# EAGLE design Pi3_Power_hat_Rev1 (EAGLE 7.6.0)

## Sheet 1 of 4
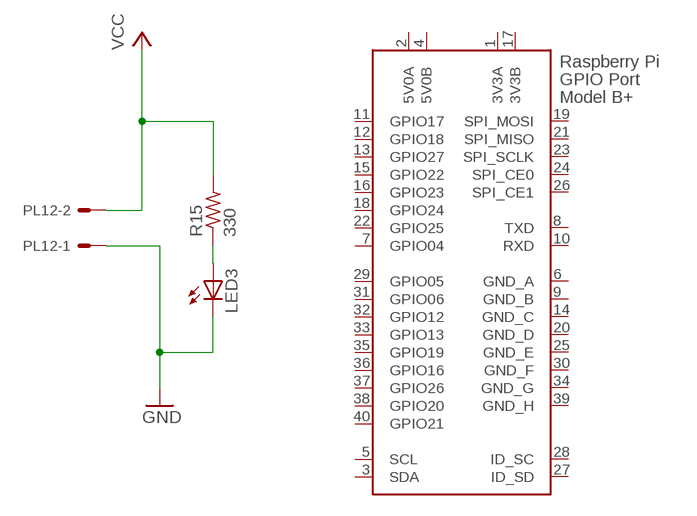
[diagram p0: schematic, sheet 1]

### Parts
LED3  LEDCHIP-LED0603  [CHIP-LED0603]
PL12  555X-2H  [5569-2]
R15  330  R-US_R0402  [R0402]
X1  RASPI_BOARD_B+#_E4P  [RASPI_BOARD_B+_EDGES_4DRILL_PAD]

### Nets
GND: LED3.C PL12.1 ; also sheet 2,3,4
N$24: LED3.A R15.1
VCC: PL12.2 R15.2 ; also sheet 2,3,4
Unconnected: X1.3(SDA) X1.5(SCL) X1.7(GPIO04) X1.8(TXD) X1.10(RXD) X1.11(GPIO17) X1.12(GPIO18) X1.13(GPIO27) X1.15(GPIO22) X1.16(GPIO23) X1.18(GPIO24) X1.19(SPI_MOSI) X1.21(SPI_MISO) X1.22(GPIO25) X1.23(SPI_SCLK) X1.24(SPI_CE0) X1.26(SPI_CE1) X1.27(ID_SD) X1.28(ID_SC) X1.29(GPIO05) X1.31(GPIO06) X1.32(GPIO12) X1.33(GPIO13) X1.35(GPIO19) X1.36(GPIO16) X1.37(GPIO26) X1.38(GPIO20) X1.40(GPIO21)

## Sheet 2 of 4
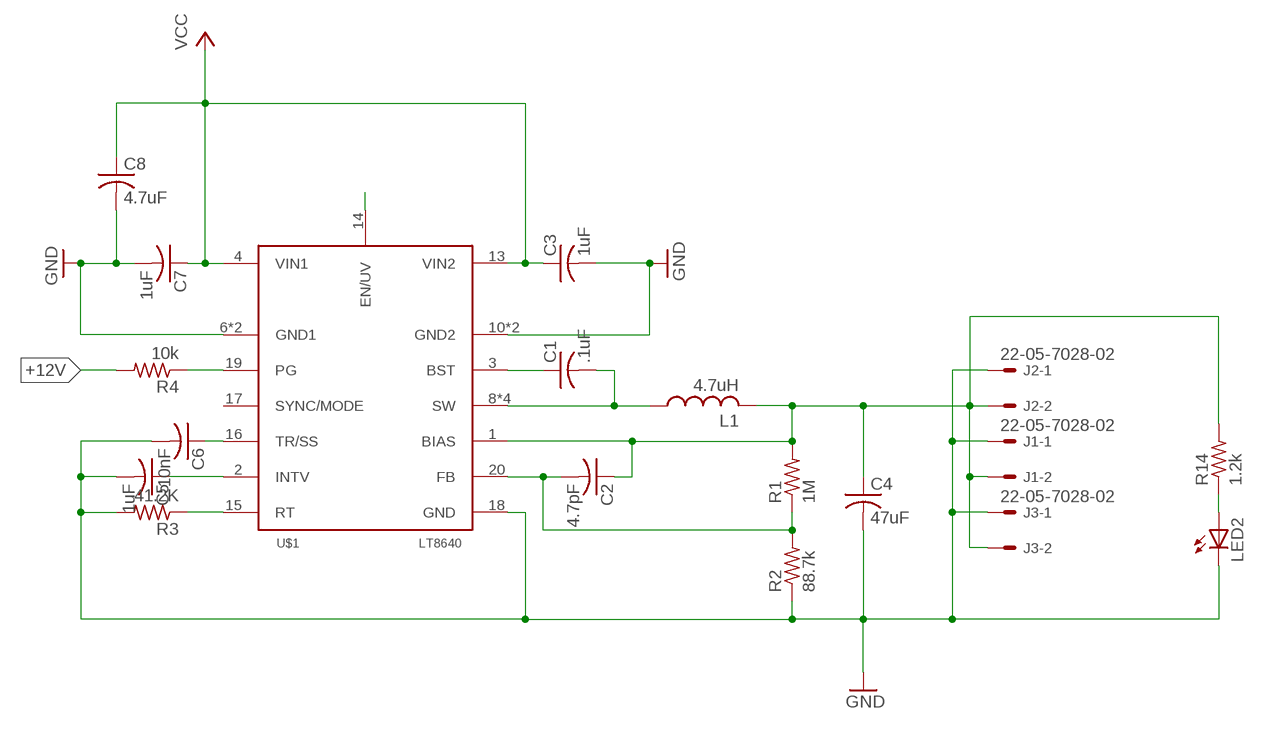
[diagram p1: schematic, sheet 2]

### Parts
C1  .1uF  C-USC0402  [C0402]
C2  4.7pF  C-USC0402  [C0402]
C3  1uF  C-USC0402  [C0402]
C4  47uF  C-USC1210  [C1210]
C5  1uF  C-USC0402  [C0402]
C6  10nF  C-USC0402  [C0402]
C7  1uF  C-USC0402  [C0402]
C8  4.7uF  C-USC0603  [C0603]
J1  22-05-7028-02  [7395-02]
J2  22-05-7028-02  [7395-02]
J3  22-05-7028-02  [7395-02]
L1  4.7uH  L-USIHLP2525EZER4R7M01  [IHLP2525EZER4R7M01-FOOT]
LED2  LEDCHIP-LED0603  [CHIP-LED0603]
R1  1M  R-US_R0402  [R0402]
R2  88.7k  R-US_R0402  [R0402]
R3  41.2K  R-US_R0402  [R0402]
R4  10k  R-US_R0402  [R0402]
R14  1.2k  R-US_R0402  [R0402]
U$1  LT8640  [LT8640_FOOT]

### Nets
+12V: C2.1 C4.1 J1.2 J2.2 J3.2 L1.2 R1.2 R4.2 R14.2 U$1.1(BIAS)
GND: C3.2 C4.2 C5.2 C6.2 C7.2 C8.2 J1.1 J2.1 J3.1 LED2.C R2.1 R3.2 U$1.6(GND1) U$1.7(GND1) U$1.10(GND2) U$1.11(GND2) U$1.18(GND) ; also sheet 1,3,4
N$1: C1.1 U$1.3(BST)
N$2: C1.2 L1.1 U$1.8(SW) U$1.9(SW) U$1.21(SW) U$1.22(SW)
N$3: R4.1 U$1.19(PG)
N$5: C2.2 R1.1 R2.2 U$1.20(FB)
N$10: C6.1 U$1.16(TR/SS)
N$11: C5.1 U$1.2(INTV)
N$12: R3.1 U$1.15(RT)
N$23: LED2.A R14.1
N$26: U$1.14(EN/UV)
VCC: C3.1 C7.1 C8.1 U$1.4(VIN1) U$1.13(VIN2) ; also sheet 1,3,4
Unconnected: U$1.17(SYNC/MODE)

## Sheet 3 of 4
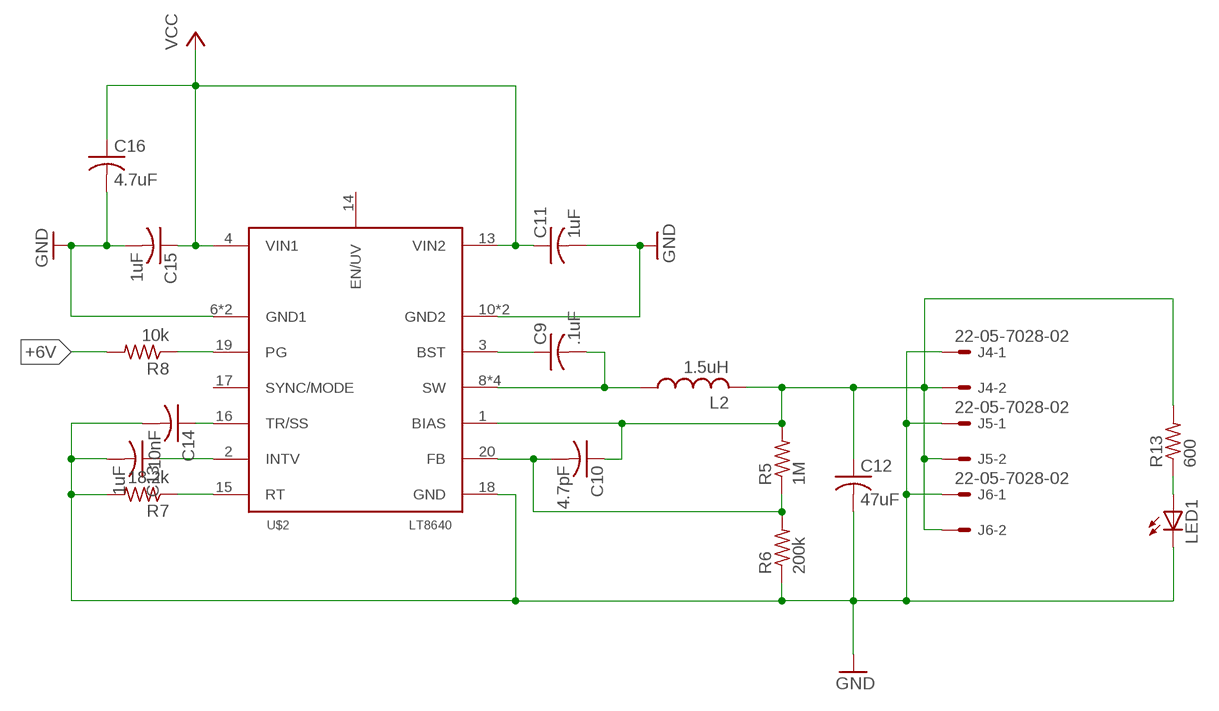
[diagram p2: schematic, sheet 3]

### Parts
C9  .1uF  C-USC0402  [C0402]
C10  4.7pF  C-USC0402  [C0402]
C11  1uF  C-USC0402  [C0402]
C12  47uF  C-USC1210  [C1210]
C13  1uF  C-USC0402  [C0402]
C14  10nF  C-USC0402  [C0402]
C15  1uF  C-USC0402  [C0402]
C16  4.7uF  C-USC0603  [C0603]
J4  22-05-7028-02  [7395-02]
J5  22-05-7028-02  [7395-02]
J6  22-05-7028-02  [7395-02]
L2  1.5uH  L-USIHLP2525EZER4R7M01  [IHLP2525EZER4R7M01-FOOT]
LED1  LEDCHIP-LED0603  [CHIP-LED0603]
R5  1M  R-US_R0402  [R0402]
R6  200k  R-US_R0402  [R0402]
R7  18.2k  R-US_R0402  [R0402]
R8  10k  R-US_R0402  [R0402]
R13  600  R-US_R0402  [R0402]
U$2  LT8640  [LT8640_FOOT]

### Nets
+6V: C10.1 C12.1 J4.2 J5.2 J6.2 L2.2 R5.2 R8.2 R13.2 U$2.1(BIAS)
GND: C11.2 C12.2 C13.2 C14.2 C15.2 C16.2 J4.1 J5.1 J6.1 LED1.C R6.1 R7.2 U$2.6(GND1) U$2.7(GND1) U$2.10(GND2) U$2.11(GND2) U$2.18(GND) ; also sheet 1,2,4
N$4: C9.1 U$2.3(BST)
N$6: C9.2 L2.1 U$2.8(SW) U$2.9(SW) U$2.21(SW) U$2.22(SW)
N$7: C10.2 R5.1 R6.2 U$2.20(FB)
N$8: C14.1 U$2.16(TR/SS)
N$9: C13.1 U$2.2(INTV)
N$13: R7.1 U$2.15(RT)
N$14: R8.1 U$2.19(PG)
N$25: LED1.A R13.1
VCC: C11.1 C15.1 C16.1 U$2.4(VIN1) U$2.13(VIN2) ; also sheet 1,2,4
Unconnected: U$2.14(EN/UV) U$2.17(SYNC/MODE)

## Sheet 4 of 4
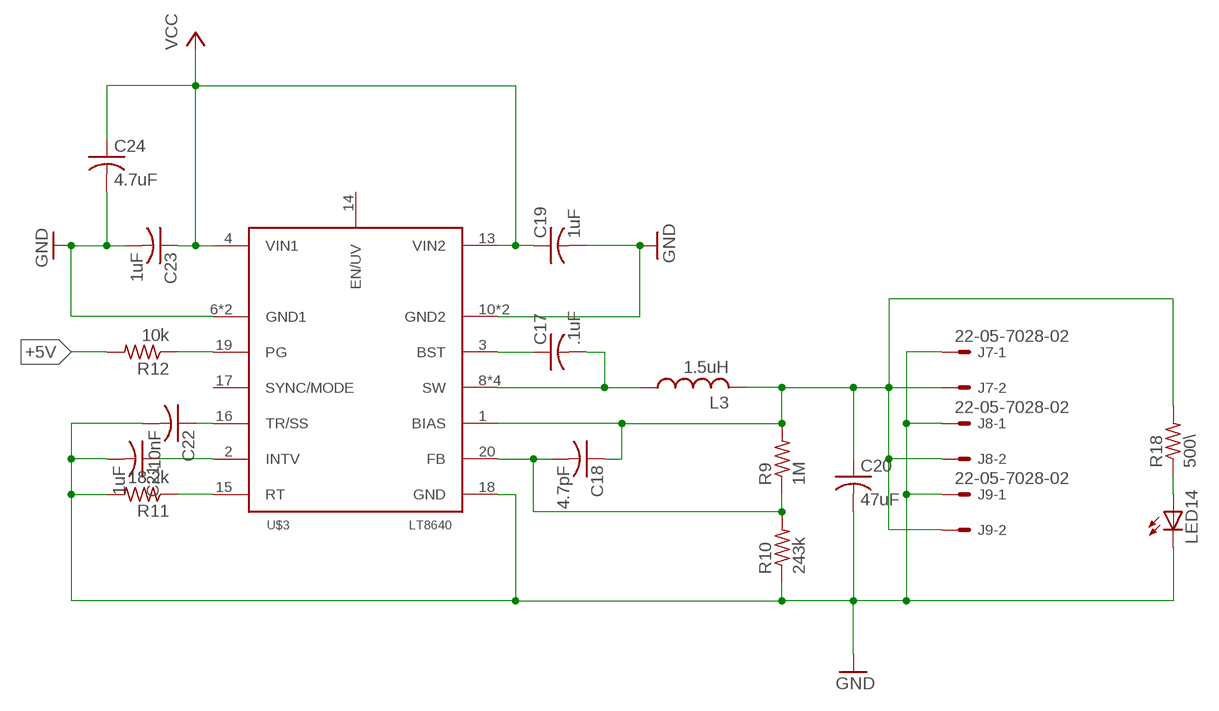
[diagram p3: schematic, sheet 4]

### Parts
C17  .1uF  C-USC0402  [C0402]
C18  4.7pF  C-USC0402  [C0402]
C19  1uF  C-USC0402  [C0402]
C20  47uF  C-USC1210  [C1210]
C21  1uF  C-USC0402  [C0402]
C22  10nF  C-USC0402  [C0402]
C23  1uF  C-USC0402  [C0402]
C24  4.7uF  C-USC0603  [C0603]
J7  22-05-7028-02  [7395-02]
J8  22-05-7028-02  [7395-02]
J9  22-05-7028-02  [7395-02]
L3  1.5uH  L-USIHLP2525EZER4R7M01  [IHLP2525EZER4R7M01-FOOT]
LED14  LEDCHIP-LED0603  [CHIP-LED0603]
R9  1M  R-US_R0402  [R0402]
R10  243k  R-US_R0402  [R0402]
R11  18.2k  R-US_R0402  [R0402]
R12  10k  R-US_R0402  [R0402]
R18  500\  R-US_R0402  [R0402]
U$3  LT8640  [LT8640_FOOT]

### Nets
+5V: C18.1 C20.1 J7.2 J8.2 J9.2 L3.2 R9.2 R12.2 R18.2 U$3.1(BIAS)
GND: C19.2 C20.2 C21.2 C22.2 C23.2 C24.2 J7.1 J8.1 J9.1 LED14.C R10.1 R11.2 U$3.6(GND1) U$3.7(GND1) U$3.10(GND2) U$3.11(GND2) U$3.18(GND) ; also sheet 1,2,3
N$15: C17.1 U$3.3(BST)
N$16: C17.2 L3.1 U$3.8(SW) U$3.9(SW) U$3.21(SW) U$3.22(SW)
N$17: C18.2 R9.1 R10.2 U$3.20(FB)
N$18: C22.1 U$3.16(TR/SS)
N$19: C21.1 U$3.2(INTV)
N$20: R11.1 U$3.15(RT)
N$21: R12.1 U$3.19(PG)
N$22: LED14.A R18.1
VCC: C19.1 C23.1 C24.1 U$3.4(VIN1) U$3.13(VIN2) ; also sheet 1,2,3
Unconnected: U$3.14(EN/UV) U$3.17(SYNC/MODE)

## Power pins joined to a net without a drawn wire
3V3A: X1.1(3V3A)
3V3B: X1.17(3V3B)
5V0A: X1.2(5V0A)
5V0B: X1.4(5V0B)
GND_A: X1.6(GND_A)
GND_B: X1.9(GND_B)
GND_C: X1.14(GND_C)
GND_D: X1.20(GND_D)
GND_E: X1.25(GND_E)
GND_F: X1.30(GND_F)
GND_G: X1.34(GND_G)
GND_H: X1.39(GND_H)

## Library data of the parts
C1-C24 = rcl:C-US: CAPACITOR, American symbol
J1-J9 = con-molex:22-?-02: CONNECTOR wire to board 2.54 mm (.1 inch) pitch header; OC_FARNELL: 9731601; OC_NEWARK: unknown
L1-L3 = Pi3_motor_hat_rev1:L-US: INDUCTOR, American symbol
LED1-LED3 LED14 = led:LED: LED OSRAM: - CHIPLED LG R971, LG N971, LY N971, LG Q971, LY Q971, LO R971, LY R971 LH N974, LH R974 LS Q976, LO Q976, LY Q976 LO Q996 - Hyper CHIPLED LW Q18S LB Q993, LB Q99A, LB R99A - SideLED LS A670, LO A670, LY A670, LG A670, LP A670 LB A673, LV A673, LT A673, LW A673 LH A674 LY A675 LS A676, LA A676, LO A676, LY A676, LW A676 LS A679, LY A679, LG A679 - Hyper Micro SIDELED® LS Y876, LA Y876, LO Y876, LY Y876 LT Y87S - SmartLED LW L88C, LW L88S LB L89C, LB L89S, LG L890 LS L89K, LO L89K, LY L89K LS L896, LA L896, LO L896, LY L896 - TOPLED LS T670, LO T670, LY T670, LG T670, LP T670 LSG T670, LSP T670, LSY T670, LOP T670, LYG T670 LG T671, LOG T671, LSG T671 LB T673, LV T673, LT T673, LW T673 LH T674 LS T676, LA T676, LO T676, LY T676, LB T676, LH T676, LSB T676, LW T676 LB T67C, LV T67C, LT T67C, LS T67K, LO T67K, LY T67K, LW E67C LS E67B, LA E67B, LO E67B, LY E67B, LB E67C, LV E67C, LT E67C LW T67C LS T679, LY T679, LG T679 LS T770, LO T770, LY T770, LG T770, LP T770 LB T773, LV T773, LT T773, LW T773 LH T774 LS E675, LA E675, LY E675, LS T675 LS T776, LA T776, LO T776, LY T776, LB T776 LHGB T686 LT T68C, LB T68C - Hyper Mini TOPLED® LB M676 - Mini TOPLED Santana® LG M470 LS M47K, LO M47K, LY M47K Source: http://www.osram.convergy.de LUXEON: - LUMILED® LXK2-PW12-R00, LXK2-PW12-S00, LXK2-PW14-U00, LXK2-PW14-V00 LXK2-PM12-R00, LXK2-PM12-S00, LXK2-PM14-U00 LXK2-PE12-Q00, LXK2-PE12-R00, LXK2-PE12-S00, LXK2-PE14-T00, LXK2-PE14-U00 LXK2-PB12-K00, LXK2-PB12-L00, LXK2-PB12-M00, LXK2-PB14-N00, LXK2-PB14-P00, LXK2-PB14-Q00 LXK2-PR12-L00, LXK2-PR12-M00, LXK2-PR14-Q00, LXK2-PR14-R00 LXK2-PD12-Q00, LXK2-PD12-R00, LXK2-PD12-S00 LXK2-PH12-R00, LXK2-PH12-S00 LXK2-PL12-P00, LXK2-PL12-Q00, LXK2-PL12-R00 Source: www.luxeon.com KINGBRIGHT: KA-3528ASYC Source: www.kingbright.com
PL12 = con-molex-2:555X-2: Mini FIT connector 2 way
R1-R15 R18 = rcl:R-US_: RESISTOR, American symbol
U$1-U$3 = Pi3_motor_hat_rev1:LT8640
X1 = Pi3_Power_hat_Rev1:RASPI_BOARD_B+#: Raspberry Pi GPIO connector with markings for the outer dimensions of the Raspberry Pi board model B+ with different sets of drill holes or mounting pads All pins connected

## Net classes
0 default: width 0.203 mm, drill 0.33 mm, clearance 0.254 mm

## Board
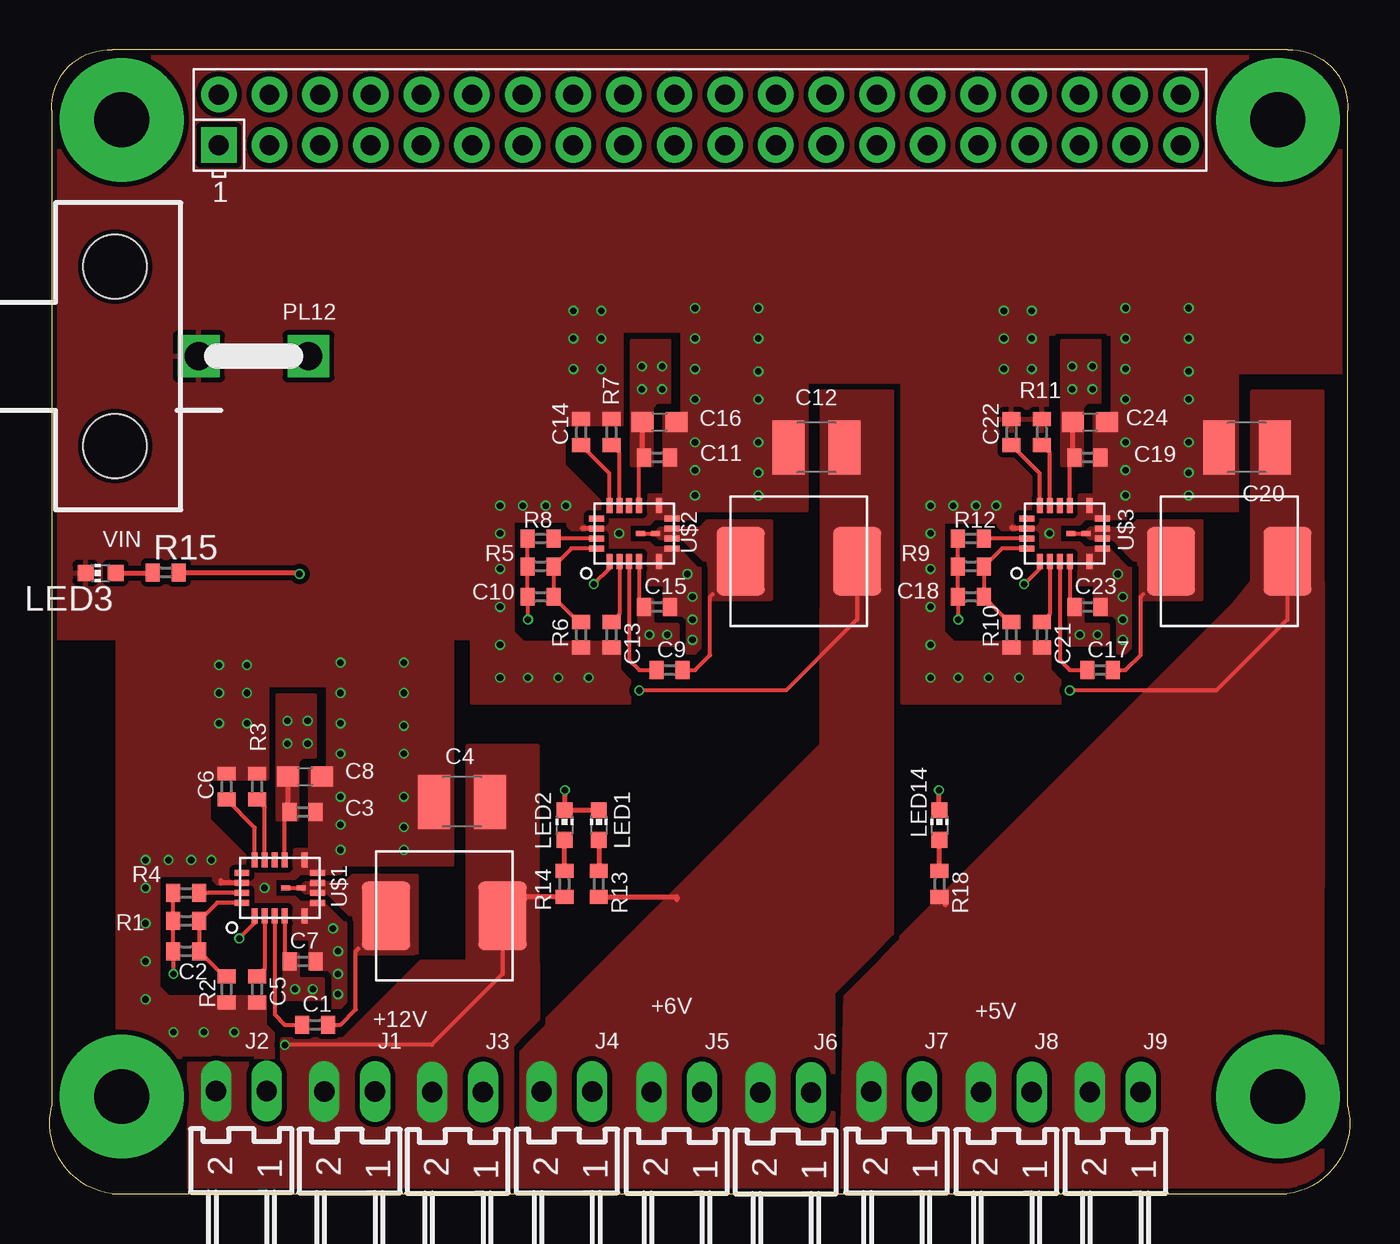
[diagram p4: board, top side]
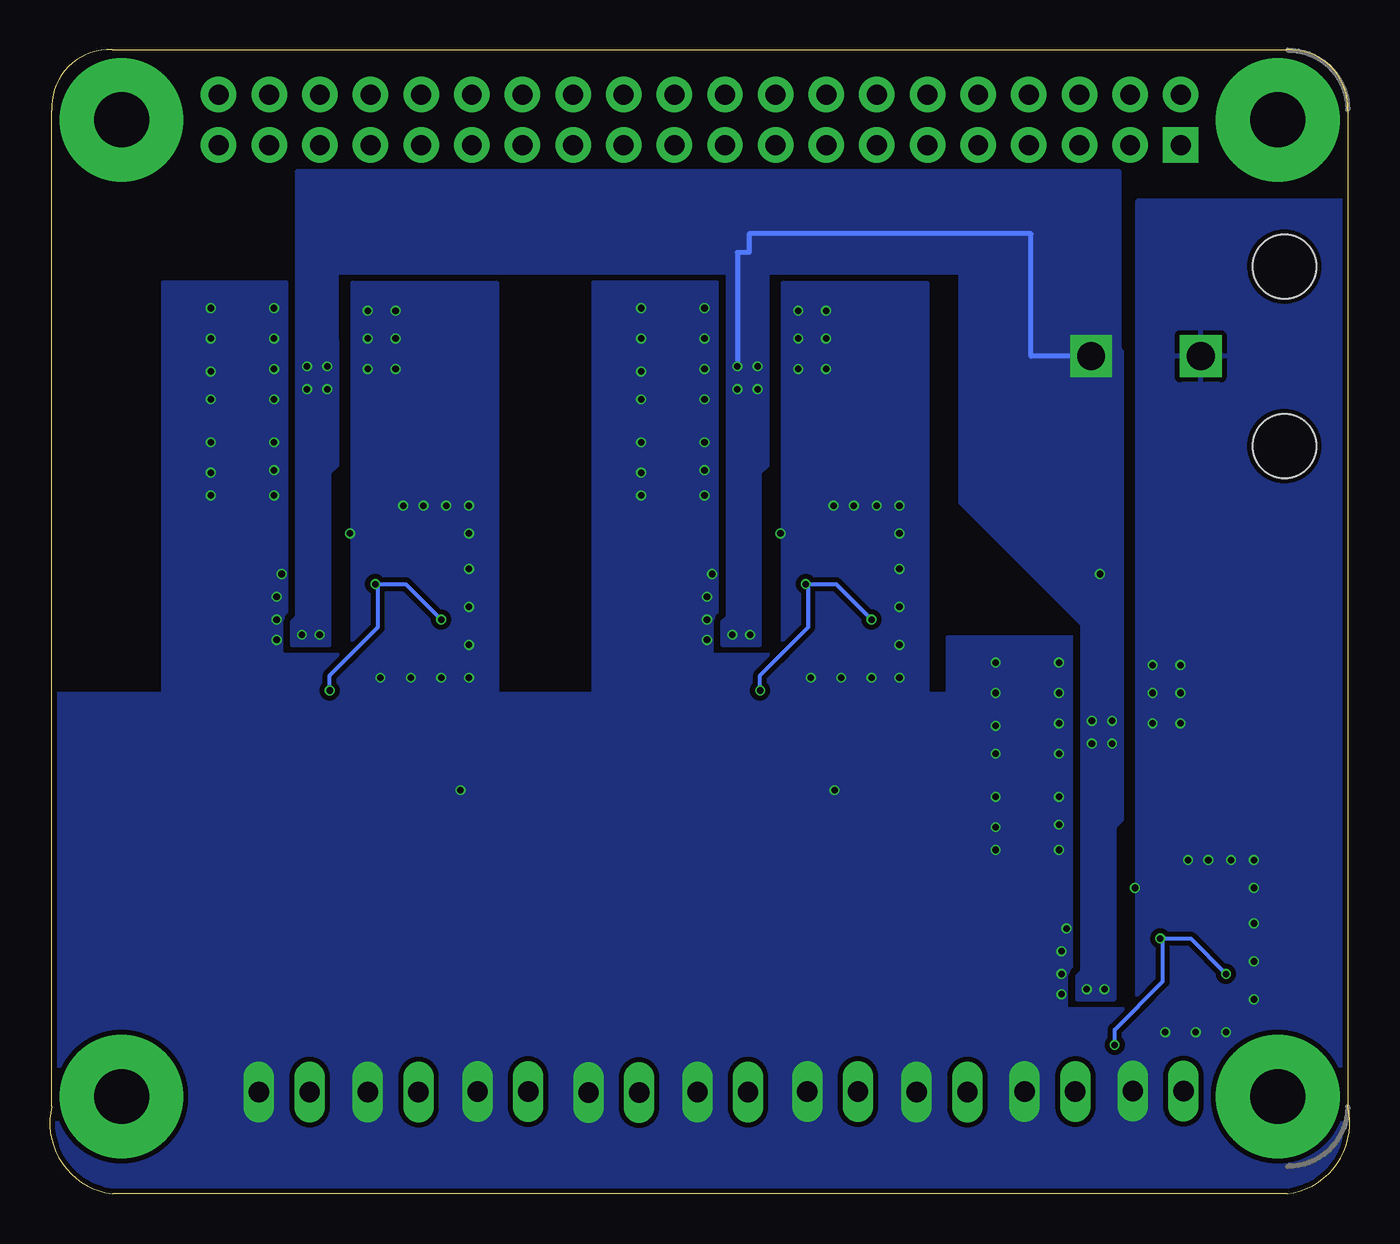
[diagram p5: board, bottom side, seen from below]

Size 65.2 x 57.38 mm. Coordinates in mm from the lower left corner, seen from the top.
Outline: 0.11,54.36 0.11,4.42 arc97 3.13,0 62.06,0 arc97 65.1,4.39 65.1,54.33 arc97 62.08,57.38 3.15,57.38 arc97 0.11,54.36
Copper layers (1*16): Top 0.035mm / dielectric 1.5mm / Bottom 0.035mm
Design rules "EagleRules-2-Layer-Shep": minimum track width 6mil, minimum drill 12mil, track to track 6mil, track to pad 6mil, pad to pad 6mil, via to via 6mil, smd to smd 0mil, copper to edge 10mil, drill to drill 10mil, minimum pad ring 2mil, minimum via ring 2mil, stop-mask expansion 2mil, vias tented up to drill 100mil, thermal gap 10mil

### Footprints (pad centres in the part's own frame; a part is rotated, then mirrored left to right if it is on the bottom)
C0402 = smd 0.7 x 0.9: 1 -0.65,0; 2 0.65,0
C1210 = smd 1.6 x 2.7: 1 -1.4,0; 2 1.4,0
C0603 = smd 1.1 x 1: 1 -0.85,0; 2 0.85,0
7395-02 = drill 1.016 long: 1 1.27,0; 2 -1.27,0
IHLP2525EZER4R7M01-FOOT = smd 2.413 x 3.429: 1 -2.921,0; 2 2.921,0
CHIP-LED0603 = smd 0.8 x 0.8: A 0,-0.75; C 0,0.75
5569-2 = drill 1.4 square: 1 0,0; 2 0,5.5 | hole 3.2: 4.5,-4.2; -4.5,-4.2
R0402 = smd 0.7 x 0.9: 1 -0.65,0; 2 0.65,0
LT8640_FOOT = smd 0.3 x 0.75: 1 1.25,1.4; 2 0.75,1.4; 3 0.25,1.4; 4 -0.25,1.4; 6 -1.25,1.4; 11 -1.25,-1.4; 13 -0.25,-1.4; 14 0.25,-1.4; 15 0.75,-1.4; 16 1.25,-1.4 | smd 0.75 x 0.3: 7 -1.9,0.75; 8 -1.9,0.25; 9 -1.9,-0.25; 10 -1.9,-0.75; 17 1.9,-0.75; 18 1.9,-0.25; 19 1.9,0.25; 20 1.9,0.75 | smd 0.45 x 0.27: 21 -1.075,0; 22 -0.305,0
RASPI_BOARD_B+_EDGES_4DRILL_PAD = drill 1 pad 1.778 square: 1 8.37,51.23 | drill 1 pad 1.778: 2 8.37,53.77; 3 10.91,51.23; 4 10.91,53.77; 5 13.45,51.23; 6 13.45,53.77; 7 15.99,51.23; 8 15.99,53.77; 9 18.53,51.23; 10 18.53,53.77; 11 21.07,51.23; 12 21.07,53.77; 13 23.61,51.23; 14 23.61,53.77; 15 26.15,51.23; 16 26.15,53.77; 17 28.69,51.23; 18 28.69,53.77; 19 31.23,51.23; 20 31.23,53.77; 21 33.77,51.23; 22 33.77,53.77; 23 36.31,51.23; 24 36.31,53.77; 25 38.85,51.23; 26 38.85,53.77; 27 41.39,51.23; 28 41.39,53.77; 29 43.93,51.23; 30 43.93,53.77; 31 46.47,51.23; 32 46.47,53.77; 33 49.01,51.23; 34 49.01,53.77; 35 51.55,51.23; 36 51.55,53.77; 37 54.09,51.23; 38 54.09,53.77; 39 56.63,51.23; 40 56.63,53.77 | drill 2.75 pad 6.2: 41 3.5,3.5; 42 61.5,3.5; 43 61.5,52.5; 44 3.5,52.5

### Placement (x,y rotation side)
C1  13.31,8.48 0 top
C2  6.84,12.17 0 top
C3  12.68,19.15 0 top
C4  20.68,19.66 180 top
C5  10.39,10.26 270 top
C6  8.87,20.42 90 top
C7  12.68,11.66 0 top
C8  12.8,20.93 0 top
C9  31.09,26.26 0 top
C10  24.62,29.95 0 top
C11  30.46,36.93 0 top
C12  38.46,37.44 180 top
C13  28.17,28.04 270 top
C14  26.65,38.2 90 top
C15  30.46,29.44 0 top
C16  30.58,38.71 0 top
C17  52.68,26.26 0 top
C18  46.21,29.95 0 top
C19  52.05,36.93 0 top
C20  60.05,37.44 180 top
C21  49.76,28.04 270 top
C22  48.24,38.2 90 top
C23  52.05,29.44 0 top
C24  52.17,38.71 0 top
J1  15.04,5.13 0 top
J2  9.6,5.16 0 top
J3  20.45,5.11 0 top
J4  25.94,5.13 0 top
J5  31.45,5.11 0 top
J6  36.91,5.08 0 top
J7  42.47,5.13 0 top
J8  47.98,5.11 0 top
J9  53.44,5.11 0 top
L1  19.79,13.94 0 top
L2  37.57,31.72 0 top
L3  59.16,31.72 0 top
LED1  27.54,18.49 0 top
LED2  25.81,18.49 0 top
LED3  2.54,31.14 90 top
LED14  44.63,18.49 0 top
PL12  7.47,42.01 270 top
R1  6.84,13.69 180 top
R2  8.87,10.26 90 top
R3  10.39,20.42 90 top
R4  6.84,15.09 180 top
R5  24.62,31.47 180 top
R6  26.65,28.04 90 top
R7  28.17,38.2 90 top
R8  24.62,32.87 180 top
R9  46.21,31.47 180 top
R10  48.24,28.04 90 top
R11  49.76,38.2 90 top
R12  46.21,32.87 180 top
R13  27.54,15.54 270 top
R14  25.81,15.54 270 top
R15  5.82,31.17 0 top
R18  44.63,15.54 270 top
U$1  11.53,15.34 180 top
U$2  29.31,33.12 180 top
U$3  50.9,33.12 180 top
X1  0.1,1.37 0 top

### Tracks (layer width: path | path; a pad name or v marks a point on that pad's centre or on a via)
+5V  (via drill 0.33)
  Top 0.203: U$3.1 49.66,31.36 v48.87,30.58 | v45.57,28.8 45.57,29.93 C18.1 R9.2 R12.2 | L3.2 62.08,28.8 58.53,25.25 v51.16,25.25
  Top 0.254: R18.2 44.91,14.89 44.91,14.5 44.94,14.5
  Bottom 0.203: v45.57,28.8 47.35,30.58 v48.87,30.58 48.75,30.45 48.75,28.42 51.16,26.01 v51.16,25.25
  pour Top (no thermals): 60.3,40.23 60.3,29.31 63.86,29.31 63.86,40.23
  pour Top (rank 3, no thermals): 60.3,30.68 59.31,29.46 39.91,10.06 39.68,0 63.83,0 63.86,30.68
+6V  (via drill 0.33)
  Top 0.203: U$2.1 28.07,31.36 v27.28,30.58 | v23.98,28.8 23.98,29.93 C10.1 R5.2 R8.2 | L2.2 40.49,28.8 36.94,25.25 v29.57,25.25
  Top 0.254: R13.2 31.45,14.89 31.45,14.76
  Bottom 0.203: v23.98,28.8 25.76,30.58 v27.28,30.58 27.16,30.45 27.16,28.42 29.57,26.01 v29.57,25.25
  pour Top (no thermals): 38.71,40.23 38.71,29.31 42.27,29.31 42.27,40.23
  pour Top (rank 2, no thermals): 38.71,29.36 38.71,22.48 23.55,7.32 23.55,-0.05 39.27,-0.05 39.27,10.11 41.35,12.19 42.24,13.08 42.24,29.31 42.24,29.36
+12V  (via drill 0.33)
  Top 0.203: U$1.1 10.29,13.58 v9.5,12.8 | v6.2,11.02 6.2,12.15 C2.1 R1.2 R4.2 | L1.2 22.71,11.02 19.16,7.47 v11.79,7.47
  Top 0.254: R14.2 23.8,14.89 23.8,14.71
  Bottom 0.203: v6.2,11.02 7.98,12.8 v9.5,12.8 9.38,12.67 9.38,10.64 11.79,8.23 v11.79,7.47
  pour Top (no thermals): 20.93,22.45 20.93,11.53 24.49,11.53 24.49,22.45
  pour Top (no thermals): 24.46,11.61 18.62,11.61 14.74,7.72 11.66,7.72 11.66,6.5 6.99,6.5 6.99,0.03 23.19,0.03 23.19,11.53
  pour Top: 21.47,6.78 21.47,11.56 24.46,11.56 24.46,8.76 22.38,6.68 21.47,6.68 21.47,6.71 21.47,6.76
GND  (via drill 0.33)
  Top 0.254: v25.84,20.24 25.84,19.24 LED2.C LED1.C | LED14.C 44.61,19.24 v44.61,20.24 | U$1.18 8.59,15.59 8.59,15.7 | U$2.18 26.7,33.37 26.7,33.38 | U$3.18 48.26,33.37 48.26,33.43
  other vias: 14.46,10.01 14.46,11.02 14.46,12.17 14.2,13.31 10.77,15.34 14.58,17.25 14.58,18.52 14.58,19.91 14.58,22.07 14.58,23.6 14.58,25.12 14.58,26.64 9.88,26.52 9.88,25.12 9.88,23.6 8.49,23.6 8.49,25.12 8.49,26.52 9.25,8.1 7.72,8.1 6.2,8.1 4.8,9.75 4.8,11.66 4.8,13.56 4.8,15.34 4.8,16.74 5.95,16.74 7.09,16.74 8.11,16.74 17.76,17.25 17.76,18.39 17.76,19.91 17.76,22.07 17.76,23.47 17.76,25.12 17.76,26.64 32.24,27.79 32.24,28.8 32.24,29.95 31.98,31.09 28.55,33.12 32.36,35.03 32.36,36.3 32.36,37.69 32.36,39.85 32.36,41.38 32.36,42.9 32.36,44.42 27.66,44.3 27.66,42.9 27.66,41.38 26.27,41.38 26.27,42.9 26.27,44.3 27.03,25.88 25.5,25.88 23.98,25.88 22.58,25.88 22.58,27.53 22.58,29.44 22.58,31.34 22.58,33.12 22.58,34.52 23.73,34.52 24.87,34.52 25.89,34.52 35.54,35.03 35.54,36.17 35.54,37.69 35.54,39.85 35.54,41.25 35.54,42.9 35.54,44.42 53.83,27.79 53.83,28.8 53.83,29.95 53.57,31.09 50.14,33.12 53.95,35.03 53.95,36.3 53.95,37.69 53.95,39.85 53.95,41.38 53.95,42.9 53.95,44.42 49.25,44.3 49.25,42.9 49.25,41.38 47.86,41.38 47.86,42.9 47.86,44.3 48.62,25.88 47.09,25.88 45.57,25.88 44.17,25.88 44.17,27.53 44.17,29.44 44.17,31.34 44.17,33.12 44.17,34.52 45.32,34.52 46.46,34.52 47.48,34.52 57.13,35.03 57.13,36.17 57.13,37.69 57.13,39.85 57.13,41.25 57.13,42.9 57.13,44.42
  pour Top (no thermals): 13.69,14.58 12.55,14.58 12.3,14.83 11.28,14.83 11.28,15.85 12.3,15.85 12.55,16.1 14.58,16.1 14.58,17.25 12.3,17.25 12.17,17.12 12.17,16.61 9.76,16.61 9.76,13.94 11.92,13.94 11.92,12.8 14.71,12.8 14.71,13.56
  pour Top (no thermals): 20.17,23.47 20.17,16.48 13.06,16.48 13.06,21.31 13.95,21.31 13.95,23.47
  pour Top (rank 2, no thermals): 9.88,15.98 3.41,15.98 3.41,27.91 20.17,27.91 20.17,23.47 13.95,23.47 13.95,25.5 10.9,25.5 10.9,20.8 7.98,20.8 7.98,18.77 9.76,16.99 9.76,16.1
  pour Top (no thermals): 13.06,12.8 13.06,11.28 13.95,11.28 14.2,11.02 14.2,9.37 14.58,9.37 14.84,9.63 14.84,13.56 13.82,13.56
  pour Top (rank 2, no thermals): 10.77,9.88 10.77,8.48 11.28,7.98 11.28,6.83 3.41,6.83 3.41,15.98 5.44,15.98 5.44,10.39 5.95,9.88
  pour Bottom (rank 2): 10.65,9.25 14.2,9.25 14.2,11.02 13.95,11.28 13.95,27.91 20.17,27.91 20.17,6.83 10.65,6.83
  pour Bottom: 10.65,6.83 10.65,27.91 3.41,27.91 3.41,6.83
  pour Top (no thermals): 10.21,15.47 8.49,15.47 8.23,15.72 8.23,16.23 8.74,16.23 8.74,15.98 8.99,15.72 10.21,15.72
  pour Top (no thermals): 31.47,32.36 30.33,32.36 30.08,32.61 29.06,32.61 29.06,33.63 30.08,33.63 30.33,33.88 32.36,33.88 32.36,35.03 30.08,35.03 29.95,34.9 29.95,34.39 27.54,34.39 27.54,31.72 29.7,31.72 29.7,30.58 32.49,30.58 32.49,31.34
  pour Top (no thermals): 37.95,41.25 37.95,34.26 30.84,34.26 30.84,39.09 31.73,39.09 31.73,41.25
  pour Top (no thermals): 27.66,33.76 21.19,33.76 21.19,45.69 37.95,45.69 37.95,41.25 31.73,41.25 31.73,43.28 28.68,43.28 28.68,38.58 25.76,38.58 25.76,36.55 27.54,34.77 27.54,33.88
  pour Top (no thermals): 30.84,30.58 30.84,29.06 31.73,29.06 31.98,28.8 31.98,27.15 32.36,27.15 32.62,27.41 32.62,31.34 31.6,31.34
  pour Top (no thermals): 28.55,27.66 28.55,26.26 29.06,25.76 29.06,24.61 21.19,24.61 21.19,33.76 23.22,33.76 23.22,28.17 23.73,27.66
  pour Bottom (rank 2): 28.43,27.03 31.98,27.03 31.98,28.8 31.73,29.06 31.73,45.69 37.95,45.69 37.95,24.61 28.43,24.61
  pour Bottom: 28.43,24.61 28.43,45.69 21.19,45.69 21.19,24.61
  pour Top (no thermals): 27.28,33.25 26.27,33.25 26.01,33.5 26.01,34.01 26.52,34.01 26.52,33.76 26.77,33.5 27.28,33.5
  pour Top (isolate 0.254, no thermals): 53.06,32.36 51.92,32.36 51.67,32.61 50.65,32.61 50.65,33.63 51.67,33.63 51.92,33.88 53.95,33.88 53.95,35.03 51.67,35.03 51.54,34.9 51.54,34.39 49.13,34.39 49.13,31.72 51.29,31.72 51.29,30.58 54.08,30.58 54.08,31.34
  pour Top (no thermals): 59.54,41.25 59.54,34.26 52.43,34.26 52.43,39.09 53.32,39.09 53.32,41.25
  pour Top (no thermals): 52.43,30.58 52.43,29.06 53.32,29.06 53.57,28.8 53.57,27.15 53.95,27.15 54.21,27.41 54.21,31.34 53.19,31.34
  pour Top (no thermals): 50.14,27.66 50.14,26.26 50.65,25.76 50.65,24.61 42.78,24.61 42.78,33.76 44.81,33.76 44.81,28.17 45.32,27.66
  pour Bottom (rank 2): 50.02,27.03 53.57,27.03 53.57,28.8 53.32,29.06 53.32,45.69 59.54,45.69 59.54,24.61 50.02,24.61
  pour Bottom: 50.02,24.61 50.02,45.69 42.78,45.69 42.78,24.61
  pour Top (no thermals): 49.79,33.27 47.86,33.25 47.6,33.5 47.6,34.01 48.11,34.01 48.11,33.76 48.36,33.5 49.51,33.5
  pour Top (rank 2): 0.13,27.89 0.13,58.29 65.43,58.29 65.43,41.22 53.34,41.22 53.34,43.15 49.99,43.15 49.99,38.63 47.91,38.63 47.91,38.53 49.99,38.53 49.99,33.73 42.8,33.73 42.8,40.74 37.77,40.74 37.77,45.67 21.21,45.67 21.21,27.89
  pour Bottom (no thermals): 0.23,8.31 20.17,8.31 20.17,25.04 66.37,25.04 66.37,0.1 0.23,0.1
  pour Bottom: 10.42,27.64 10.62,27.64 10.62,28.3 10.62,49.81 0.1,49.81 0.1,-0.03 6.79,-0.03 10.62,-0.03 10.62,27.23 10.39,27.23 10.39,27.64
N$1
  Top 0.203: U$1.3 11.29,8.99 11.79,8.48 C1.1
N$2
  Top 0.203: U$1.22 U$1.21 | C1.2 14.58,8.48 15.35,9.25 15.35,12.17 15.47,12.29
  pour Top (rank 2, no thermals): 18.39,15.98 18.39,12.04 15.34,12.04 15.34,13.69 13.95,15.09 12.68,15.09 12.55,15.21 12.55,15.47 12.68,15.6 14.84,15.6 15.22,15.98
N$3
  Top 0.203: U$1.19 R4.1
N$4
  Top 0.203: U$2.3 29.07,26.77 29.57,26.26 C9.1
N$5
  Top 0.203: U$1.20 8.39,14.59 R1.1 C2.2 8.74,10.91 R2.2
N$6
  Top 0.203: U$2.22 U$2.21 | C9.2 32.36,26.26 33.13,27.03 33.13,29.95 33.25,30.07
  pour Top (rank 2, no thermals): 36.17,33.76 36.17,29.82 33.12,29.82 33.12,31.47 31.73,32.87 30.46,32.87 30.33,32.99 30.33,33.25 30.46,33.38 32.62,33.38 33,33.76
N$7
  Top 0.203: U$2.20 26.17,32.37 R5.1 C10.2 26.52,28.69 R6.2
N$8
  Top 0.203: U$2.16 28.07,36.14 C14.1
N$9
  Top 0.203: U$2.2 28.57,29.09 C13.1
N$10
  Top 0.203: U$1.16 10.29,18.36 C6.1
N$11
  Top 0.203: U$1.2 10.79,11.3 C5.1
N$12
  Top 0.203: U$1.15 10.79,19.38 R3.1
N$13
  Top 0.203: U$2.15 28.57,37.16 R7.1
N$14
  Top 0.203: U$2.19 R8.1
N$15
  Top 0.203: U$3.3 50.66,26.77 51.16,26.26 C17.1
N$16
  Top 0.203: U$3.22 U$3.21 | C17.2 53.95,26.26 54.72,27.03 54.72,29.95 54.84,30.07
  pour Top (isolate 0.254, rank 2, no thermals): 57.76,33.76 57.76,29.82 54.71,29.82 54.71,31.47 53.32,32.87 52.05,32.87 51.92,32.99 51.92,33.25 52.05,33.38 54.21,33.38 54.59,33.76
N$17
  Top 0.203: U$3.20 47.76,32.37 R9.1 C18.2 48.11,28.69 R10.2
N$18
  Top 0.203: U$3.16 49.66,36.14 C22.1
N$19
  Top 0.203: U$3.2 50.16,29.09 C21.1
N$20
  Top 0.203: U$3.15 50.16,37.16 R11.1
N$21
  Top 0.203: U$3.19 R12.1
N$22
  Top 0.254: R18.1 LED14.A
N$23
  Top 0.254: R14.1 LED2.A
N$24
  Top 0.254: LED3.A 5.17,31.14 R15.1
N$25
  Top 0.254: LED1.A R13.1
VCC  (via drill 0.33)
  Top 0.203: U$1.4 11.79,12.03 C7.1 | U$1.13 11.79,18.91 C3.1 | U$2.4 29.57,29.81 C15.1 | U$2.13 29.57,36.69 C11.1 | U$3.4 51.16,29.81 C23.1 | U$3.13 51.16,36.69 C19.1
  Top 0.254: 51.16,36.69 51.33,36.69 C24.1 | C11.1 29.74,36.93 C16.1 | C3.1 11.96,19.15 C8.1 | R15.2 12.53,31.17 v12.53,31.09
  Bottom 0.254: PL12.2 15.98,42.01 15.98,48.16 30.13,48.16 30.13,47.22 30.71,47.22 v30.71,41.5
  other vias: 12.3,10.26 13.19,10.26 11.92,22.58 11.92,23.72 12.93,22.58 12.93,23.72 30.08,28.04 30.97,28.04 30.71,40.36 51.67,28.04 52.56,28.04 51.29,40.36 51.29,41.5 52.3,40.36 52.3,41.5 29.7,41.5 29.7,40.36
  pour Bottom (isolate 0.254, no thermals): 11.56,42.27 11.56,51.28 52.78,51.28 52.78,42.75 50.8,42.75 50.8,46.23 31.19,46.23 31.19,42.82 29.21,42.82 29.21,46.23 19.54,46.23 19.54,34.7 13.41,28.57 13.41,24.99 11.43,24.99 11.43,42.27
  pour Top (no thermals): 12.42,18.77 12.42,21.69 12.68,21.95 13.31,21.95 13.31,24.99 11.41,24.99 11.41,18.77
  pour Bottom: 13.44,24.99 13.44,11.15 13.69,10.9 13.69,9.75 11.79,9.75 11.79,18.39 11.41,18.77 11.41,24.99
  pour Top (no thermals): 12.42,12.04 12.42,10.9 12.55,10.77 13.69,10.77 13.69,9.75 11.79,9.75 11.79,12.04
  pour Bottom: 31.22,42.77 31.22,28.93 31.47,28.68 31.47,27.53 29.57,27.53 29.57,36.17 29.19,36.55 29.19,42.77
  pour Top (no thermals): 30.2,36.55 30.2,39.47 30.46,39.73 31.09,39.73 31.09,42.77 29.19,42.77 29.19,36.55
  pour Top (no thermals): 30.2,29.82 30.2,28.68 30.33,28.55 31.47,28.55 31.47,27.53 29.57,27.53 29.57,29.82
  pour Bottom: 52.81,42.77 52.81,28.93 53.06,28.68 53.06,27.53 51.16,27.53 51.16,36.17 50.78,36.55 50.78,42.77
  pour Top (no thermals): 51.79,36.55 51.79,39.47 52.05,39.73 52.68,39.73 52.68,42.77 50.78,42.77 50.78,36.55
  pour Top (no thermals): 51.79,29.82 51.79,28.68 51.92,28.55 53.06,28.55 53.06,27.53 51.16,27.53 51.16,29.82

### Text on the board
tPlace: VIN | +6V | +12V | +5V